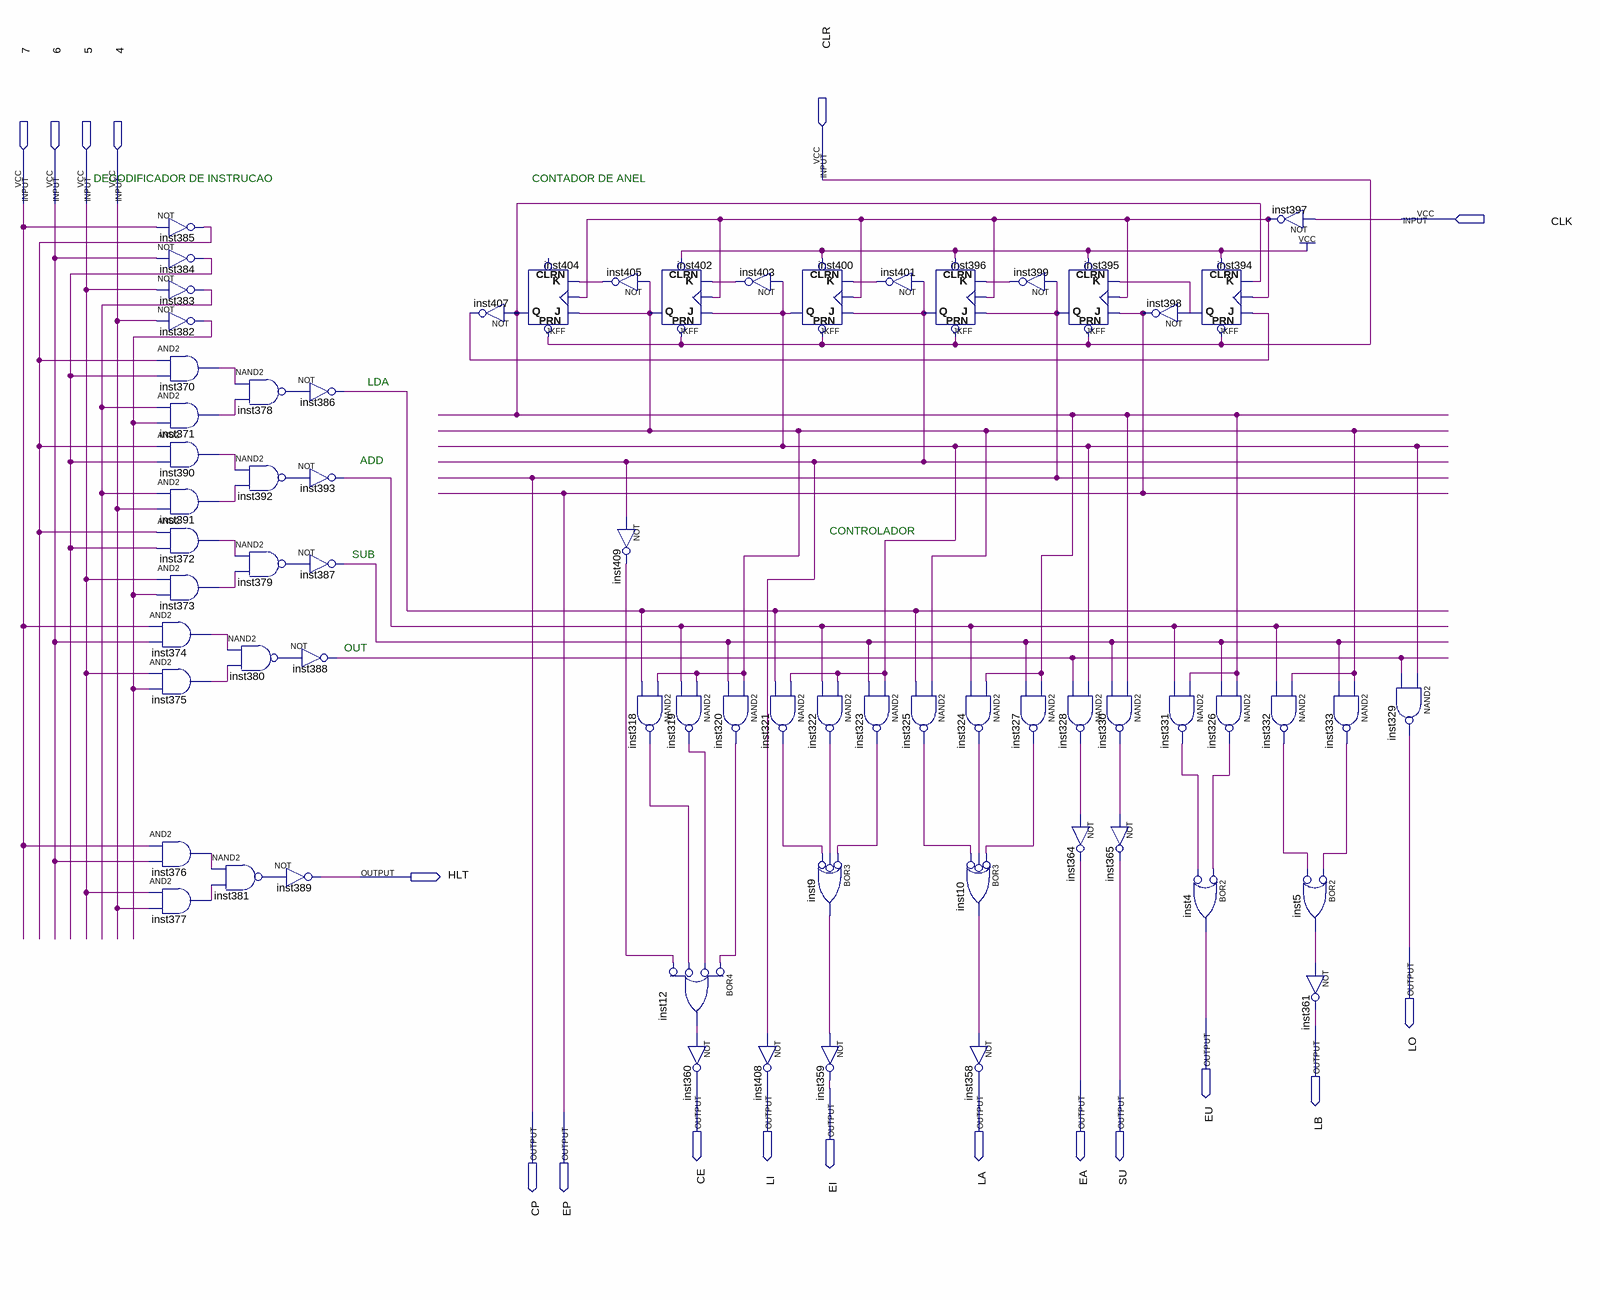
[diagram p0: schematic sheet]
// Quartus schematic CONTROLADOR.bdf as structural Verilog: 66 symbols, 18 pins
module CONTROLADOR (
  input  CLR,
  input  \7 ,
  input  \6 ,
  input  \5 ,
  input  \4 ,
  input  CLK,
  output HLT,
  output LO,
  output EU,
  output LB,
  output CE,
  output LI,
  output LA,
  output EA,
  output SU,
  output EI,
  output CP,
  output EP
);

  wire inst5_out, inst9_out, inst10_out, inst12_out, inst318_out, inst319_out, inst320_out, inst321_out,
       inst322_out, inst323_out, inst324_out, inst325_out, inst326_out, inst327_out, inst328_out,
       inst330_out, inst331_out, inst332_out, inst333_out, inst370_out, inst371_out, inst372_out,
       inst373_out, inst374_out, inst375_out, inst376_out, inst377_out, inst378_out, inst379_out,
       inst380_out, inst381_out, inst382_out, inst383_out, inst384_out, inst385_out, inst386_out,
       inst387_out, inst388_out, inst390_out, inst391_out, inst392_out, inst393_out, inst394_q, inst396_q,
       inst397_out, inst399_out, inst400_q, inst401_out, inst402_q, inst403_out, inst404_q, inst405_out,
       inst407_out, inst409_out;

  not inst385 (inst385_out, \7 );
  not inst384 (inst384_out, \6 );
  not inst383 (inst383_out, \5 );
  not inst382 (inst382_out, \4 );
  and inst370 (inst370_out, inst385_out, inst384_out);
  and inst371 (inst371_out, inst383_out, inst382_out);
  and inst390 (inst390_out, inst385_out, inst384_out);
  and inst391 (inst391_out, inst383_out, \4 );
  and inst372 (inst372_out, inst385_out, inst384_out);
  and inst373 (inst373_out, \5 , inst382_out);
  and inst374 (inst374_out, \7 , \6 );
  and inst375 (inst375_out, \5 , inst382_out);
  and inst376 (inst376_out, \7 , \6 );
  and inst377 (inst377_out, \5 , \4 );
  nand inst381 (inst381_out, inst376_out, inst377_out);
  nand inst378 (inst378_out, inst370_out, inst371_out);
  nand inst392 (inst392_out, inst390_out, inst391_out);
  nand inst379 (inst379_out, inst372_out, inst373_out);
  nand inst380 (inst380_out, inst374_out, inst375_out);
  not inst389 (HLT, inst381_out);
  not inst386 (inst386_out, inst378_out);
  not inst393 (inst393_out, inst392_out);
  not inst387 (inst387_out, inst379_out);
  not inst388 (inst388_out, inst380_out);
  not inst407 (inst407_out, inst404_q);
  JKFF inst404 (.PRN(CLR), .K(inst405_out), .J(inst402_q), .CLK(inst397_out), .Q(inst404_q));  // open: CLRN
  JKFF inst402 (.PRN(CLR), .CLRN(1'b1), .K(inst403_out), .J(inst400_q), .CLK(inst397_out), .Q(inst402_q));
  not inst405 (inst405_out, inst402_q);
  not inst409 (inst409_out, inst396_q);
  nand inst318 (inst318_out, inst402_q, inst386_out);
  or inst12 (inst12_out, ~inst320_out, ~inst319_out, ~inst318_out, ~inst409_out);  // BOR4
  nand inst319 (inst319_out, inst402_q, inst393_out);
  nand inst320 (inst320_out, inst402_q, inst387_out);
  not inst360 (CE, inst12_out);
  not inst403 (inst403_out, inst400_q);
  nand inst321 (inst321_out, inst400_q, inst386_out);
  not inst408 (LI, inst396_q);
  JKFF inst400 (.PRN(CLR), .CLRN(1'b1), .K(inst401_out), .J(inst396_q), .CLK(inst397_out), .Q(inst400_q));
  nand inst322 (inst322_out, inst400_q, inst393_out);
  or inst9 (inst9_out, ~inst323_out, ~inst322_out, ~inst321_out);  // BOR3
  not inst359 (EI, inst9_out);
  not inst401 (inst401_out, inst396_q);
  nand inst323 (inst323_out, inst400_q, inst387_out);
  nand inst325 (inst325_out, inst402_q, inst386_out);
  JKFF inst396 (.PRN(CLR), .CLRN(1'b1), .K(inst399_out), .J(CP), .CLK(inst397_out), .Q(inst396_q));
  nand inst324 (inst324_out, inst404_q, inst393_out);
  or inst10 (inst10_out, ~inst327_out, ~inst324_out, ~inst325_out);  // BOR3
  not inst358 (LA, inst10_out);
  not inst399 (inst399_out, CP);
  nand inst327 (inst327_out, inst404_q, inst387_out);
  JKFF inst395 (.PRN(CLR), .CLRN(1'b1), .K(inst394_q), .J(EP), .CLK(inst397_out), .Q(CP));
  nand inst328 (inst328_out, inst400_q, inst388_out);
  nand inst330 (inst330_out, inst404_q, inst387_out);
  not inst364 (EA, inst328_out);
  not inst398 (EP, inst394_q);
  nand inst331 (inst331_out, inst404_q, inst393_out);
  not inst365 (SU, inst330_out);
  JKFF inst394 (.PRN(CLR), .CLRN(1'b1), .K(inst404_q), .J(inst407_out), .CLK(inst397_out), .Q(inst394_q));
  nand inst326 (inst326_out, inst404_q, inst387_out);
  or inst4 (EU, ~inst326_out, ~inst331_out);  // BOR2
  not inst397 (inst397_out, CLK);
  nand inst332 (inst332_out, inst402_q, inst393_out);
  nand inst333 (inst333_out, inst402_q, inst387_out);
  or inst5 (inst5_out, ~inst333_out, ~inst332_out);  // BOR2
  not inst361 (LB, inst5_out);
  nand inst329 (LO, inst400_q, inst388_out);

  // Notes on the sheet:
  //   DECODIFICADOR DE INSTRUCAO
  //   CONTADOR DE ANEL
  //   LDA
  //   ADD
  //   CONTROLADOR
  //   SUB
  //   OUT
endmodule
